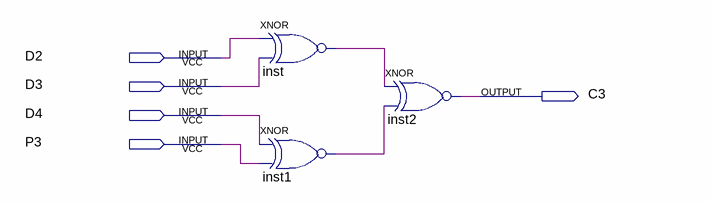
[diagram p0: schematic sheet]
// Quartus schematic check_c3.bdf as structural Verilog: 3 symbols, 5 pins
module check_c3 (
  input  D2,
  input  D3,
  input  D4,
  input  P3,
  output C3
);

  wire inst1_out, inst_out;

  xnor inst (inst_out, D2, D3);
  xnor inst1 (inst1_out, D4, P3);
  xnor inst2 (C3, inst_out, inst1_out);
endmodule
